# Altium project ESP32_With_USB-C_Port.PrjPcb
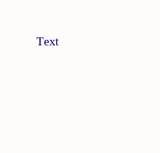
[diagram p0: ESP32_With_USB-C_Port_AL.SchDoc, top left]
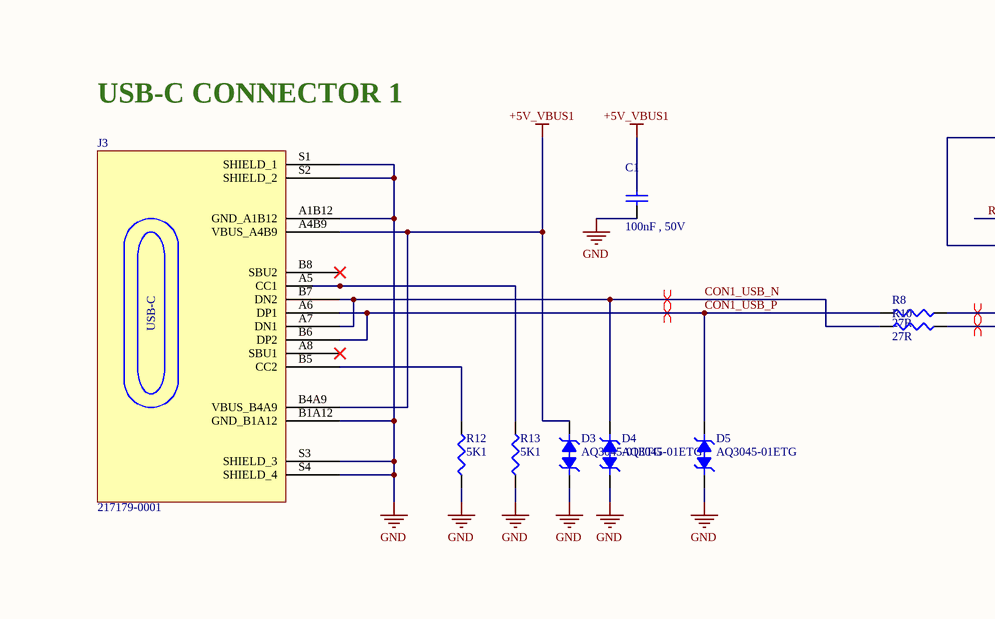
[diagram p1: ESP32_With_USB-C_Port_AL.SchDoc, top middle]
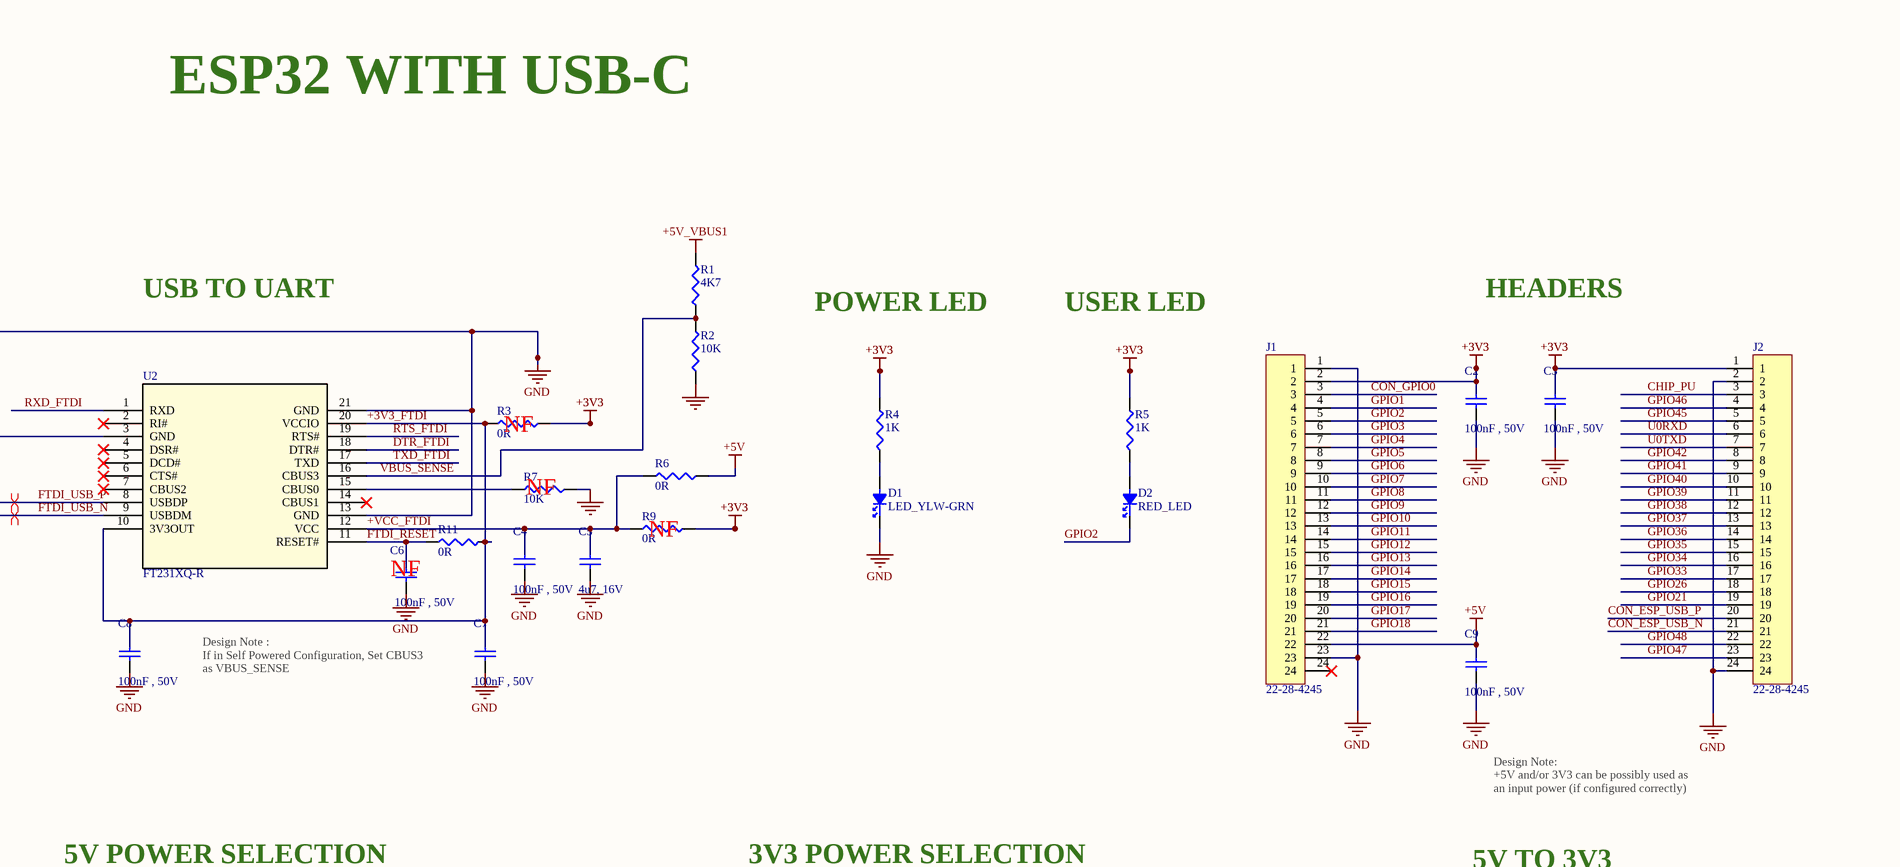
[diagram p2: ESP32_With_USB-C_Port_AL.SchDoc, top right]
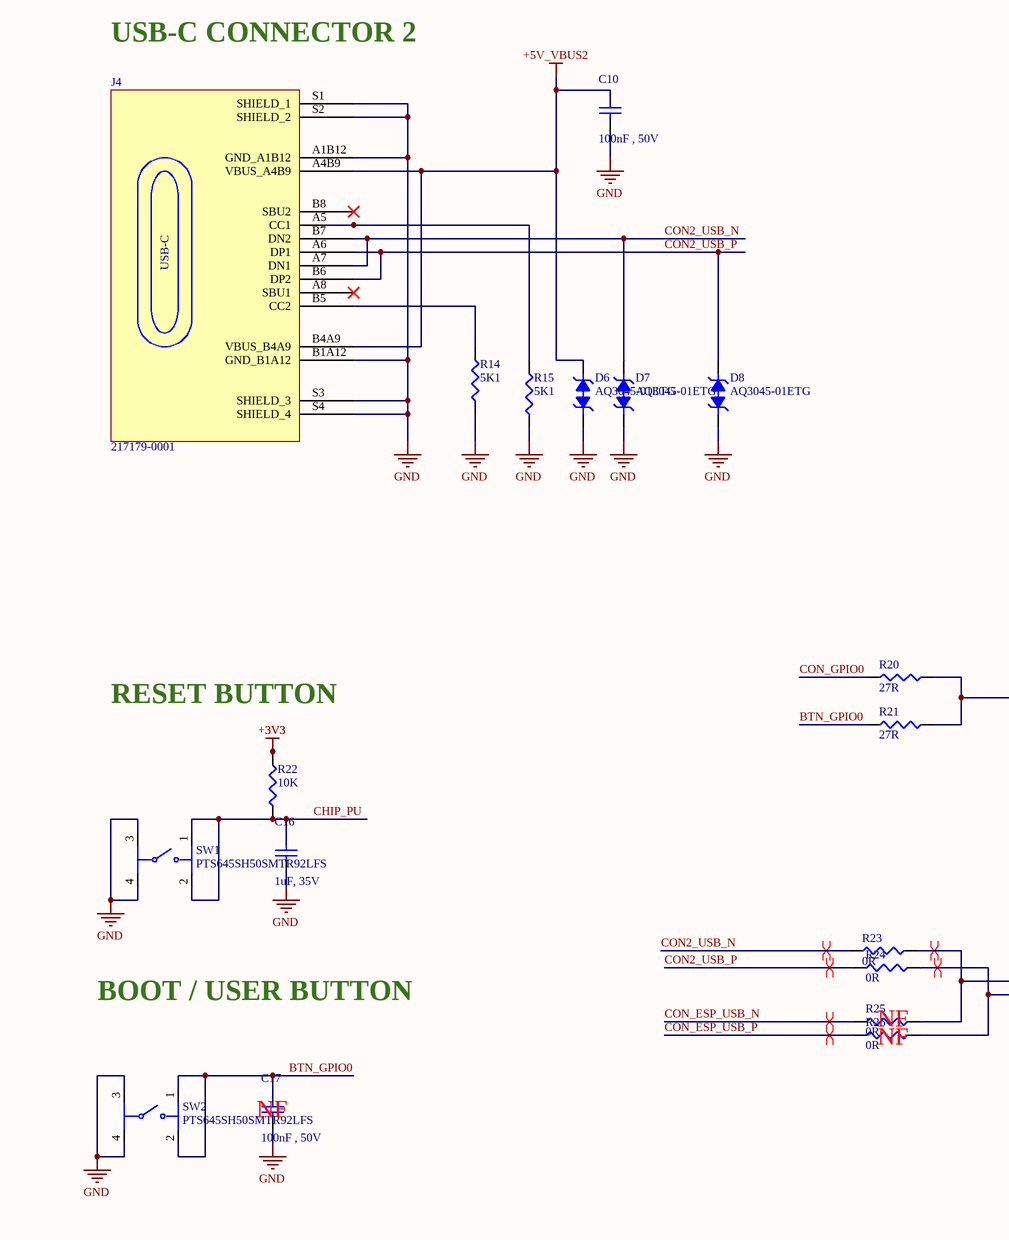
[diagram p3: ESP32_With_USB-C_Port_AL.SchDoc, bottom middle]
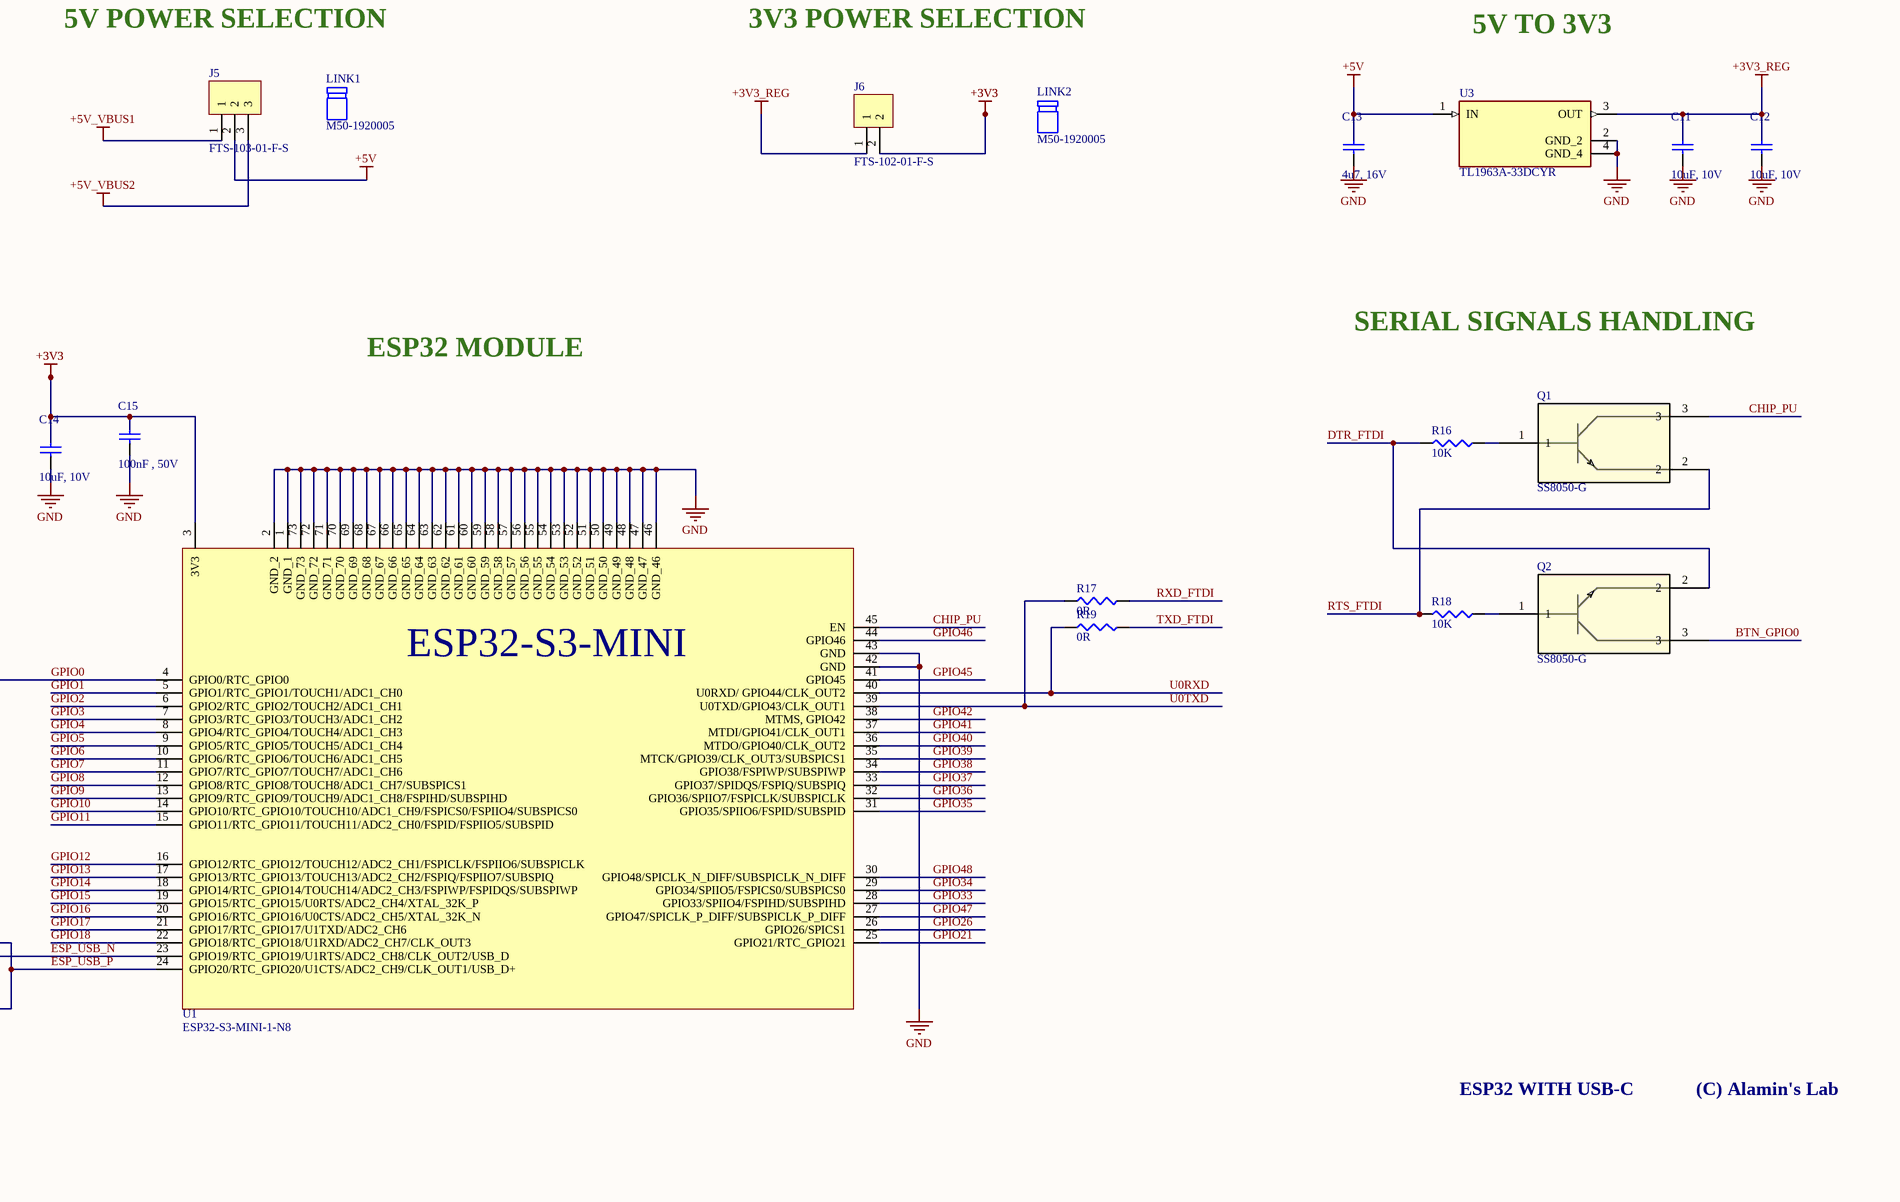
[diagram p4: ESP32_With_USB-C_Port_AL.SchDoc, bottom right]
1 sheet, 66 parts. Net scope: global (net labels, ports and power ports of the same name join across sheets).
Board file: ESP32_With_USB-C_Port_AL.PcbDoc

## Sheet ESP32_With_USB-C_Port_AL.SchDoc
size A2; SheetNumber: 1; SheetTotal: 1

### Parts
C1  100nF , 50V  [CAPC1005X70N_ALL]
C2  100nF , 50V  [CAPC1005X70N_ALL]
C3  100nF , 50V  [CAPC1005X70N_ALL]
C4  100nF , 50V  [CAPC1005X70N_ALL]
C5  4u7, 16V  [CAPC1005X70N_ALL]
C6  100nF , 50V  [CAPC1005X70N_ALL]
C7  100nF , 50V  [CAPC1005X70N_ALL]
C8  100nF , 50V  [CAPC1005X70N_ALL]
C9  100nF , 50V  [CAPC1005X70N_ALL]
C10  100nF , 50V  [CAPC1005X70N_ALL]
C11  10uF, 10V  [CAPC1005X70N_ALL]
C12  10uF, 10V  [CAPC1005X70N_ALL]
C13  4u7, 16V  [CAPC1005X70N_ALL]
C14  10uF, 10V  [CAPC1005X70N_ALL]
C15  100nF , 50V  [CAPC1005X70N_ALL]
C16  1uF, 35V  [CAPC1005X70N_ALL]
C17  100nF , 50V  [CAPC1005X70N_ALL]
D1  LED_YLW-GRN  [LED_0402_YLW_GR]
D2  RED_LED  [LED_0402_RED_01- duplicate]
D3  AQ3045-01ETG  [RTVS_SOD882_LTF-M]
D4  AQ3045-01ETG  [RTVS_SOD882_LTF-M]
D5  AQ3045-01ETG  [RTVS_SOD882_LTF-M]
D6  AQ3045-01ETG  [RTVS_SOD882_LTF-M]
D7  AQ3045-01ETG  [RTVS_SOD882_LTF-M]
D8  AQ3045-01ETG  [RTVS_SOD882_LTF-M]
J1  22-28-4245  [CONN_SD-42375-001_M295_24_MOL]
J2  22-28-4245  [CONN_SD-42375-001_M295_24_MOL]
J3  217179-0001  [MOLEX_2171790001]
J4  217179-0001  [MOLEX_2171790001]
J5  FTS-103-01-F-S  [CONN_FTS-103-01-x-S_SAI]
J6  FTS-102-01-F-S  [CONN_FTS-102-01-x-S_SAI]
LINK1  M50-1920005  (mechanical)
LINK2  M50-1920005  (mechanical)
Q1  SS8050-G  [TRAN_SS8050-G_CIP]
Q2  SS8050-G  [TRAN_SS8050-G_CIP]
R1  4K7  [RESC1005X40N]
R2  10K  [RESC1005X37N_10k]
R3  0R  [RESC1005X40_0]
R4  1K  [RESC1005X40N_1k]
R5  1K  [RESC1005X40N_1k]
R6  0R  [RESC1005X40_0]
R7  10K  [RESC1005X37N_10k]
R8  27R  [RESC1005X40N_27]
R9  0R  [RESC1005X40_0]
R10  27R  [RESC1005X40N_27]
R11  0R  [RESC1005X40_0]
R12  5K1  [RESC1005X37N_5.1]
R13  5K1  [RESC1005X37N_5.1]
R14  5K1  [RESC1005X37N_5.1]
R15  5K1  [RESC1005X37N_5.1]
R16  10K  [RESC1005X37N_10k]
R17  0R  [RESC1005X40_0]
R18  10K  [RESC1005X37N_10k]
R19  0R  [RESC1005X40_0]
R20  27R  [RESC1005X40N_27]
R21  27R  [RESC1005X40N_27]
R22  10K  [RESC1005X37N_10k]
R23  0R  [RESC1005X40_0]
R24  0R  [RESC1005X40_0]
R25  0R  [RESC1005X40_0]
R26  0R  [RESC1005X40_0]
SW1  PTS645SH50SMTR92LFS  [PTS645S_SMTR92_CNK]
SW2  PTS645SH50SMTR92LFS  [PTS645S_SMTR92_CNK]
U1  ESP32-S3-MINI-1-N8  [XCVR_ESP32-S3-MINI-1-N8]
U2  FT231XQ-R  [QFN20_FT231XQ_FTD-M]
U3  TL1963A-33DCYR  [VREG_TL1963A-33DCYR]

### Nets
+3V3: C2.2 C3.2 C14.2 C15.2 J1.2 J2.1 J6.2 R3.2 R4.2 R5.2 R9.2 R22.2 U1.3(3V3)
+3V3_REG: C11.2 C12.2 J6.1 U3.3(OUT)
+5V: C9.2 C13.2 J1.22 J5.2 R6.2 U3.1(IN)
+5V_VBUS1: C1.2 D3.2 J3.A4B9(VBUS_A4B9) J3.B4A9(VBUS_B4A9) J5.1 R1.2
+5V_VBUS2: C10.2 D6.2 J4.A4B9(VBUS_A4B9) J4.B4A9(VBUS_B4A9) J5.3
GND: C1.1 C2.1 C3.1 C4.1 C5.1 C6.1 C7.1 C8.1 C9.1 C10.1 C11.1 C12.1 C13.1 C14.1 C15.1 C16.1 C17.1 D1.1 D3.1 D4.1 D5.1 D6.1 D7.1 D8.1 J1.1 J1.23 J2.2 J2.24 J3.A1B12(GND_A1B12) J3.B1A12(GND_B1A12) J3.S1(SHIELD_1) J3.S2(SHIELD_2) J3.S3(SHIELD_3) J3.S4(SHIELD_4) J4.A1B12(GND_A1B12) J4.B1A12(GND_B1A12) J4.S1(SHIELD_1) J4.S2(SHIELD_2) J4.S3(SHIELD_3) J4.S4(SHIELD_4) R2.1 R7.2 R12.1 R13.1 R14.1 R15.1 SW1.3 SW1.4 SW2.3 SW2.4 U1.1(GND_1) U1.2(GND_2) U1.42(GND) U1.43(GND) U1.46(GND_46) U1.47(GND_47) U1.48(GND_48) U1.49(GND_49) U1.50(GND_50) U1.51(GND_51) U1.52(GND_52) U1.53(GND_53) U1.54(GND_54) U1.55(GND_55) U1.56(GND_56) U1.57(GND_57) U1.58(GND_58) U1.59(GND_59) U1.60(GND_60) U1.61(GND_61) U1.62(GND_62) U1.63(GND_63) U1.64(GND_64) U1.65(GND_65) U1.66(GND_66) U1.67(GND_67) U1.68(GND_68) U1.69(GND_69) U1.70(GND_70) U1.71(GND_71) U1.72(GND_72) U1.73(GND_73) U2.3(GND) U2.13(GND) U2.21(GND) U3.2(GND_2) U3.4(GND_4)
+3V3_FTDI: C7.2 C8.2 R3.1 R11.1 U2.10(3V3OUT) U2.20(VCCIO)
+VCC_FTDI: C4.2 C5.2 R6.1 R9.1 U2.12(VCC)
BTN_GPIO0: C17.2 Q2.3 R21.1 SW2.1 SW2.2
CHIP_PU: C16.2 J2.3 Q1.3 R22.1 SW1.1 SW1.2 U1.45(EN)
CON1_USB_N: D4.2 J3.A7(DN1) J3.B7(DN2) R10.1
CON1_USB_P: D5.2 J3.A6(DP1) J3.B6(DP2) R8.1
CON2_USB_N: D7.2 J4.A7(DN1) J4.B7(DN2) R23.1
CON2_USB_P: D8.2 J4.A6(DP1) J4.B6(DP2) R24.1
CON_ESP_USB_N: J2.21 R25.1
CON_ESP_USB_P: J2.20 R26.1
CON_GPIO0: J1.3 R20.1
DTR_FTDI: Q2.2 R16.2 U2.18(DTR#)
ESP_USB_N: R23.2 R25.2 U1.23(GPIO19/RTC_GPIO19/U1RTS/ADC2_CH8/CLK_OUT2/USB_D)
ESP_USB_P: R24.2 R26.2 U1.24(GPIO20/RTC_GPIO20/U1CTS/ADC2_CH9/CLK_OUT1/USB_D+)
FTDI_RESET: C6.2 R11.2 U2.11(RESET#)
FTDI_USB_N: R10.2 U2.9(USBDM)
FTDI_USB_P: R8.2 U2.8(USBDP)
GPIO0: R20.2 R21.2 U1.4(GPIO0/RTC_GPIO0)
GPIO1: J1.4 U1.5(GPIO1/RTC_GPIO1/TOUCH1/ADC1_CH0)
GPIO2: D2.1 J1.5 U1.6(GPIO2/RTC_GPIO2/TOUCH2/ADC1_CH1)
GPIO3: J1.6 U1.7(GPIO3/RTC_GPIO3/TOUCH3/ADC1_CH2)
GPIO4: J1.7 U1.8(GPIO4/RTC_GPIO4/TOUCH4/ADC1_CH3)
GPIO5: J1.8 U1.9(GPIO5/RTC_GPIO5/TOUCH5/ADC1_CH4)
GPIO6: J1.9 U1.10(GPIO6/RTC_GPIO6/TOUCH6/ADC1_CH5)
GPIO7: J1.10 U1.11(GPIO7/RTC_GPIO7/TOUCH7/ADC1_CH6)
GPIO8: J1.11 U1.12(GPIO8/RTC_GPIO8/TOUCH8/ADC1_CH7/SUBSPICS1)
GPIO9: J1.12 U1.13(GPIO9/RTC_GPIO9/TOUCH9/ADC1_CH8/FSPIHD/SUBSPIHD)
GPIO10: J1.13 U1.14(GPIO10/RTC_GPIO10/TOUCH10/ADC1_CH9/FSPICS0/FSPIIO4/SUBSPICS0)
GPIO11: J1.14 U1.15(GPIO11/RTC_GPIO11/TOUCH11/ADC2_CH0/FSPID/FSPIIO5/SUBSPID)
GPIO12: J1.15 U1.16(GPIO12/RTC_GPIO12/TOUCH12/ADC2_CH1/FSPICLK/FSPIIO6/SUBSPICLK)
GPIO13: J1.16 U1.17(GPIO13/RTC_GPIO13/TOUCH13/ADC2_CH2/FSPIQ/FSPIIO7/SUBSPIQ)
GPIO14: J1.17 U1.18(GPIO14/RTC_GPIO14/TOUCH14/ADC2_CH3/FSPIWP/FSPIDQS/SUBSPIWP)
GPIO15: J1.18 U1.19(GPIO15/RTC_GPIO15/U0RTS/ADC2_CH4/XTAL_32K_P)
GPIO16: J1.19 U1.20(GPIO16/RTC_GPIO16/U0CTS/ADC2_CH5/XTAL_32K_N)
GPIO17: J1.20 U1.21(GPIO17/RTC_GPIO17/U1TXD/ADC2_CH6)
GPIO18: J1.21 U1.22(GPIO18/RTC_GPIO18/U1RXD/ADC2_CH7/CLK_OUT3)
GPIO21: J2.19 U1.25(GPIO21/RTC_GPIO21)
GPIO26: J2.18 U1.26(GPIO26/SPICS1)
GPIO33: J2.17 U1.28(GPIO33/SPIIO4/FSPIHD/SUBSPIHD)
GPIO34: J2.16 U1.29(GPIO34/SPIIO5/FSPICS0/SUBSPICS0)
GPIO35: J2.15 U1.31(GPIO35/SPIIO6/FSPID/SUBSPID)
GPIO36: J2.14 U1.32(GPIO36/SPIIO7/FSPICLK/SUBSPICLK)
GPIO37: J2.13 U1.33(GPIO37/SPIDQS/FSPIQ/SUBSPIQ)
GPIO38: J2.12 U1.34(GPIO38/FSPIWP/SUBSPIWP)
GPIO39: J2.11 U1.35(MTCK/GPIO39/CLK_OUT3/SUBSPICS1)
GPIO40: J2.10 U1.36(MTDO/GPIO40/CLK_OUT2)
GPIO41: J2.9 U1.37(MTDI/GPIO41/CLK_OUT1)
GPIO42: J2.8 U1.38(MTMS,_GPIO42)
GPIO45: J2.5 U1.41(GPIO45)
GPIO46: J2.4 U1.44(GPIO46)
GPIO47: J2.23 U1.27(GPIO47/SPICLK_P_DIFF/SUBSPICLK_P_DIFF)
GPIO48: J2.22 U1.30(GPIO48/SPICLK_N_DIFF/SUBSPICLK_N_DIFF)
RTS_FTDI: Q1.2 R18.2 U2.19(RTS#)
RXD_FTDI: R17.2 U2.1(RXD)
TXD_FTDI: R19.2 U2.17(TXD)
U0RXD: J2.6 R19.1 U1.40(U0RXD/_GPIO44/CLK_OUT2)
U0TXD: J2.7 R17.1 U1.39(U0TXD/GPIO43/CLK_OUT1)
VBUS_SENSE: R1.1 R2.2 U2.16(CBUS3)
NetD1_2: D1.2 R4.1
NetD2_2: D2.2 R5.1
NetJ3_A5: J3.A5(CC1) R13.2
NetJ3_B5: J3.B5(CC2) R12.2
NetJ4_A5: J4.A5(CC1) R15.2
NetJ4_B5: J4.B5(CC2) R14.2
NetQ1_1: Q1.1 R16.1
NetQ2_1: Q2.1 R18.1
NetR7_1: R7.1 U2.15(CBUS0)

Not connected (* = marked no-connect by the designer): J1 24*; J3 A8(SBU1)* B8(SBU2)*; J4 A8(SBU1)* B8(SBU2)*; U2 2(RI#)* 4(DSR#)* 5(DCD#)* 6(CTS#)* 7(CBUS2)* 14(CBUS1)*

### Layout directives
differential pair; differential pair class DIFF90: CON1_USB_N, CON1_USB_P, CON2_USB_N, CON2_USB_P, CON_ESP_USB_N, CON_ESP_USB_P, ESP_USB_N, ESP_USB_P, FTDI_USB_N, FTDI_USB_P

### Notes on the sheet
- Text
- ESP32 WITH USB-C
- USB-C CONNECTOR 1
- USB TO UART
- HEADERS
- POWER LED
- USER LED
- (near R3) NF
- (near R7) NF
- (near C6) NF
- (near R9) NF
- Design Note :
  If in Self Powered Configuration, Set CBUS3 as VBUS_SENSE
- Design Note:
  +5V and/or 3V3 can be possibly used as an input power (if configured correctly)
- USB-C CONNECTOR 2
- 5V POWER SELECTION
- 3V3 POWER SELECTION
- 5V TO 3V3
- ESP32 MODULE
- SERIAL SIGNALS HANDLING
- RESET BUTTON
- BOOT / USER BUTTON
- NF
- (near C17) NF
- (C) Alamin's Lab
- (in symbol 217179-0001) USB-C
- (in symbol ESP32-S3-MINI-1-N8) ESP32-S3-MINI

### Library data of the parts
C1-C4 C6-C10 C15 C17 = CL05B104KB54PNC: CAP CER 0.1UF 50V X7R 0402; Manufacturer: Samsung; Material: 4241ConductorMaterial; Tolerance: 10%; Supplier: Digikey; Supplier Part Number: 1276-CL05B104KB54PNCDKR-ND; Manufacturer Part Number: CL05B104KB54PNC; RoHS: Yes; Category: Ceramic Capacitors; Stock: 1836220; Pricing: 1=0.1, 10=0.037, 100=0.0211, 1000=0.01333, 2500=0.01141, 5000=0.01026 (USD); Case/Package: 343Case; Min Operating Temperature: -55°C; Max Operating Temperature: 125°C; Value: 100nF; Voltage Rating: 50V; Height: 550um; RoHS Compliant: Yes; LCSC Part Number: C307331
C5 C13 = CL05A475MO5NUNC: CAP CER 4.7UF 16V X5R 0402; Manufacturer: Samsung; Tolerance: 20%; Supplier: Digikey; Supplier Part Number: 1276-6836-1-ND; Manufacturer Part Number: CL05A475MO5NUNC; RoHS: Yes; Category: Ceramic Capacitors; Stock: 102750; Pricing: 1=0.19, 10=0.114, 100=0.0851 (USD); Mounting Technology: Surface Mount; Case/Package: 0402; Case Code (Metric): 1005; Case Code (Imperial): 0402; Min Operating Temperature: -55°C; Max Operating Temperature: 85°C; Packaging: Cut Tape; Value: 4.7uF; Voltage Rating: 16V; Series: CL; Voltage Rating (DC): 16V; Length: 0.039inch; Width: 0.02inch; Height: 550um; Thickness: 0.022inch; RoHS Compliant: Yes; ComponentLink1URL: http://www.farnell.com/datasheets/2710653.pdf?src-supplier=Farnell; ComponentLink1Description: http://www.farnell.com/datasheets/2710653.pdf?src-supplier=Farnell; ComponentLink2URL: http://www.samsungsem.com/kr/support/product-search/mlcc/CL05A475MO5NUNC.jsp?src-supplier=Digikey; ComponentLink2Description: http://www.samsungsem.com/kr/support/product-search/mlcc/CL05A475MO5NUNC.jsp?src-supplier=Digikey; ComponentLink3URL: http://www.farnell.com/datasheets/2710653.pdf?src-supplier=Element14; ComponentLink3Description: http://www.farnell.com/datasheets/2710653.pdf?src-supplier=Element14; ComponentLink4URL: https://datasheet.octopart.com/CL05A475MO5NUNC-Samsung-Electro-Mechanics-datasheet-123102911.pdf?src-supplier=Future+Electronics; ComponentLink4Description: https://datasheet.octopart.com/CL05A475MO5NUNC-Samsung-Electro-Mechanics-datasheet-123102911.pdf?src-supplier=Future+Electronics; ComponentLink5URL: http://www.farnell.com/datasheets/2710653.pdf?src-supplier=Newark; ComponentLink5Description: http://www.farnell.com/datasheets/2710653.pdf?src-supplier=Newark; LCSC Part Number: C318563
C11 C12 C14 = CL05A106MP8NUB8: CAP CER 10UF 10V X5R 0402; Manufacturer: Samsung; Material: 4241ConductorMaterial; Tolerance: 20%; Supplier: Digikey; Supplier Part Number: 1276-6830-6-ND; Manufacturer Part Number: CL05A106MP8NUB8; RoHS: Yes; Category: Ceramic Capacitors; Stock: 116604; Pricing: 1=0.2, 10=0.12, 100=0.0808, 1000=0.06854 (USD); Mounting Technology: Surface Mount; Case/Package: 0402; Case Code (Metric): 1005; Case Code (Imperial): 0402; Min Operating Temperature: -55°C; Max Operating Temperature: 85°C; Packaging: Cut Tape; Value: 10uF; Voltage Rating: 10V; Series: CL; Length: 0.039inch; Width: 0.02inch; Height: 550um; Thickness: 0.035inch; RoHS Compliant: Yes; ComponentLink1URL: http://www.samsungsem.com/kr/support/product-search/mlcc/CL05A106MP8NUB8.jsp?src-supplier=Digikey; ComponentLink1Description: http://www.samsungsem.com/kr/support/product-search/mlcc/CL05A106MP8NUB8.jsp?src-supplier=Digikey; ComponentLink2URL: https://datasheet.octopart.com/CL05A106MP8NUB8-Samsung-Electro-Mechanics-datasheet-136460857.pdf?src-supplier=Future+Electronics; ComponentLink2Description: https://datasheet.octopart.com/CL05A106MP8NUB8-Samsung-Electro-Mechanics-datasheet-136460857.pdf?src-supplier=Future+Electronics; LCSC Part Number: C307415
C16 = CL05A106MP8NUB8 (2): CAP CER 1UF 35V X5R 0402; Manufacturer: Samsung; Material: 4241ConductorMaterial; Value: 10uF; Voltage Rating: 10V; Tolerance: 20%; Supplier: Digikey; Supplier Part Number: 1276-6830-1-ND; Manufacturer Part Number: CL05A106MP8NUB8; RoHS: Yes; Category: Ceramic Capacitors; Stock: 116604; Pricing: 1=0.2, 10=0.12, 100=0.0808, 1000=0.06854 (USD); Mounting Technology: Surface Mount; Case/Package: 0402; Case Code (Metric): 1005; Case Code (Imperial): 0402; Min Operating Temperature: -55°C; Max Operating Temperature: 85°C; Packaging: Cut Tape; Series: CL; Length: 0.039inch; Width: 0.02inch; Height: 550um; Thickness: 0.035inch; RoHS Compliant: Yes; ComponentLink1URL: http://www.samsungsem.com/kr/support/product-search/mlcc/CL05A106MP8NUB8.jsp?src-supplier=Digikey; ComponentLink1Description: http://www.samsungsem.com/kr/support/product-search/mlcc/CL05A106MP8NUB8.jsp?src-supplier=Digikey; ComponentLink2URL: https://datasheet.octopart.com/CL05A106MP8NUB8-Samsung-Electro-Mechanics-datasheet-136460857.pdf?src-supplier=Future+Electronics; ComponentLink2Description: https://datasheet.octopart.com/CL05A106MP8NUB8-Samsung-Electro-Mechanics-datasheet-136460857.pdf?src-supplier=Future+Electronics; LCSC Part Number: C307413
D1 = VLMG1500-GS08: LED YLW-GRN 0402 SMD; Manufacturer: Vishay; Color: Green,Yellow; Lens Color: Clear; Viewing Angle: 130°; Illumination Color: Green; Forward Current: 30mA; Forward Voltage: 2V; Luminous Intensity: 35mcd; Dominant Wavelength: 571nm; Test Current: 20mA; Number of Elements: 1; Power Dissipation: 75mW; Lens Style: Rectangular; Reverse Voltage: 5V; Supplier: Digikey; Supplier Part Number: VLMG1500-GS08CT-ND; Manufacturer Part Number: VLMG1500-GS08; RoHS: Yes; Category: LEDs; Stock: 150454; Pricing: 1=0.24, 10=0.164, 100=0.1147, 500=0.09218, 1000=0.0847 (USD); Mounting Technology: Surface Mount; Case/Package: 0402; Pins: 2; Case Code (Metric): 1005; Case Code (Imperial): 0402; Min Operating Temperature: -30°C; Max Operating Temperature: 85°C; Package Quantity: 1; Packaging: Tape and Reel; Wavelength: 571nm; Number of LEDs: 1; Power Rating: 75mW; Series: CHipLED; Length: 1mm; Width: 0.5mm; Height: 0.35mm; Depth: 0.5mm; Radiation Hardening: No; Lead Free: Lead Free; RoHS Compliant: Yes; Reach SVHC Compliant: Unknown; ComponentLink1URL: https://datasheet.ciiva.com/12071/vlmo1500-244705-12071911.pdf?src-supplier=Mouser; ComponentLink1Description: https://datasheet.ciiva.com/12071/vlmo1500-244705-12071911.pdf?src-supplier=Mouser; ComponentLink2URL: https://datasheet.ciiva.com/30005/vlmo1500-30005134.pdf?src-supplier=Avnet; ComponentLink2Description: https://datasheet.ciiva.com/30005/vlmo1500-30005134.pdf?src-supplier=Avnet; LCSC Part Number: C511404
D2 = VLMS1500-GS08: LED RED 0402 SMD; Manufacturer: Vishay; Viewing Angle: 130°; Forward Current: 30mA; Forward Voltage: 2V; Luminous Intensity: 54mcd; Dominant Wavelength: 631nm; Test Current: 20mA; Lens Style: Flat,Rectangular,Square; Number of LEDs: 1; Power Rating: 75mW; Lens Size: 0.5mm; Supplier: Digikey; Supplier Part Number: VLMS1500-GS08CT-ND; Manufacturer Part Number: VLMS1500-GS08; RoHS: Yes; Category: LEDs; Stock: 64500; Pricing: 1=0.24, 10=0.164, 100=0.1147, 500=0.09218, 1000=0.0847 (USD); Mounting Technology: Surface Mount; Case/Package: 0402; Pins: 2; Color: Red; Case Code (Metric): 1005; Case Code (Imperial): 0402; Min Operating Temperature: -30°C; Max Operating Temperature: 85°C; Package Quantity: 9000; Packaging: Tape and Reel; Illumination Color: Red; Wavelength: 631nm; Series: CHipLED; Length: 1mm; Width: 0.5mm; Height: 0.55mm; Radiation Hardening: No; Lead Free: Lead Free; RoHS Compliant: Yes; Reach SVHC Compliant: Unknown; ComponentLink1URL: http://components.arrow.com/part/dataview/56357384S461524N5680?src-supplier=Arrow+Electronics; ComponentLink1Description: http://components.arrow.com/part/dataview/56357384S461524N5680?src-supplier=Arrow+Electronics; ComponentLink2URL: http://www.mouser.com/ds/2/427/vlmo1500-244705.pdf?src-supplier=Mouser; ComponentLink2Description: http://www.mouser.com/ds/2/427/vlmo1500-244705.pdf?src-supplier=Mouser; ComponentLink3URL: http://www.farnell.com/datasheets/1809983.pdf?src-supplier=Farnell; ComponentLink3Description: http://www.farnell.com/datasheets/1809983.pdf?src-supplier=Farnell; ComponentLink4URL: http://www.alliedelec.com/m/d/cfc385e1097fc985ee9a50a3551ac188.pdf?src-supplier=Allied+Electronics; ComponentLink4Description: http://www.alliedelec.com/m/d/cfc385e1097fc985ee9a50a3551ac188.pdf?src-supplier=Allied+Electronics; ComponentLink5URL: https://datasheet.octopart.com/VLMS1500-GS08-Vishay-datasheet-62332426.pdf?src-supplier=Newark; ComponentLink5Description: https://datasheet.octopart.com/VLMS1500-GS08-Vishay-datasheet-62332426.pdf?src-supplier=Newark; ComponentLink6URL: http://www.vishay.com/docs/82554/vlmo1500.pdf?src-supplier=Avnet; ComponentLink6Description: http://www.vishay.com/docs/82554/vlmo1500.pdf?src-supplier=Avnet; ComponentLink7URL: https://datasheet.octopart.com/VLMS1500-GS08-Vishay-datasheet-21227148.pdf?src-supplier=Future+Electronics; ComponentLink7Description: https://datasheet.octopart.com/VLMS1500-GS08-Vishay-datasheet-21227148.pdf?src-supplier=Future+Electronics; ComponentLink8URL: http://www.farnell.com/datasheets/2050839.pdf?src-supplier=Newark; ComponentLink8Description: http://www.farnell.com/datasheets/2050839.pdf?src-supplier=Newark; ComponentLink9URL: http://www.farnell.com/datasheets/1809983.pdf?src-supplier=Element14; ComponentLink9Description: http://www.farnell.com/datasheets/1809983.pdf?src-supplier=Element14; ComponentLink10URL: https://datasheet.octopart.com/VLMS1500-GS08-Vishay-datasheet-33014519.pdf?src-supplier=Element14; ComponentLink10Description: https://datasheet.octopart.com/VLMS1500-GS08-Vishay-datasheet-33014519.pdf?src-supplier=Element14; ComponentLink11URL: http://www.farnell.com/datasheets/1809983.pdf?src-supplier=Newark; ComponentLink11Description: http://www.farnell.com/datasheets/1809983.pdf?src-supplier=Newark; ComponentLink12URL: http://datasheet.octopart.com/VLMS1500-GS08-Vishay-datasheet-21227148.pdf?src-supplier=Avnet; ComponentLink12Description: http://datasheet.octopart.com/VLMS1500-GS08-Vishay-datasheet-21227148.pdf?src-supplier=Avnet; ComponentLink13URL: http://datasheet.octopart.com/VLMS1500-GS08-Vishay-datasheet-21227148.pdf?src-supplier=LCSC; ComponentLink13Description: http://datasheet.octopart.com/VLMS1500-GS08-Vishay-datasheet-21227148.pdf?src-supplier=LCSC; ComponentLink14URL: http://datasheet.octopart.com/VLMS1500-GS08-Vishay-datasheet-21227148.pdf?src-supplier=Quest; ComponentLink14Description: http://datasheet.octopart.com/VLMS1500-GS08-Vishay-datasheet-21227148.pdf?src-supplier=Quest; ComponentLink15URL: http://datasheet.octopart.com/VLMS1500-GS08-Vishay-datasheet-21227148.pdf?src-supplier=NAC+Semi; ComponentLink15Description: http://datasheet.octopart.com/VLMS1500-GS08-Vishay-datasheet-21227148.pdf?src-supplier=NAC+Semi; LCSC Part Number: C511370
D3-D8 = AQ3045-01ETG: TVS DIODE 5.3VWM 12VC SOD882; Manufacturer: Littelfuse; Number of Bidirectional Channels: 1; Reverse Standoff Voltage: 5.3V; Min Breakdown Voltage: 6.8V; Peak Pulse Current: 3A; Peak Pulse Power: 40W; Power Line Protection: No; Diode Type: ZENER; Leakage Current: 100nA; Number of Channels: 1NUMBER; Supplier: Digikey; Supplier Part Number: F9321CT-ND; Manufacturer Part Number: AQ3045-01ETG; RoHS: Yes; Category: TVS Diodes; Stock: 10015; Pricing: 1=0.46, 10=0.302, 100=0.141, 500=0.1335, 1000=0.1302 (USD); Mounting Technology: Surface Mount; Min Operating Temperature: -55°C; Max Operating Temperature: 150°C; Packaging: Cut Tape; Series: Automotive, AEC-Q101, AQ3045, SPA®; Operating Supply Voltage: 5.3V; RoHS Compliant: Yes; ComponentLink1URL: https://www.littelfuse.com/~/media/electronics/datasheets/tvs_diode_arrays/littelfuse_tvs_diode_array_aq3045_datasheet.pdf.pdf?src-supplier=Digikey; ComponentLink1Description: https://www.littelfuse.com/~/media/electronics/datasheets/tvs_diode_arrays/littelfuse_tvs_diode_array_aq3045_datasheet.pdf.pdf?src-supplier=Digikey; ComponentLink2URL: http://www.littelfuse.com/~/media/electronics/datasheets/tvs_diode_arrays/littelfuse_tvs_diode_array_aq3045_datasheet.pdf.pdf?src-supplier=Digikey; ComponentLink2Description: http://www.littelfuse.com/~/media/electronics/datasheets/tvs_diode_arrays/littelfuse_tvs_diode_array_aq3045_datasheet.pdf.pdf?src-supplier=Digikey; LCSC Part Number: C3710326
J1 J2 = 22-28-4245: CONN HEADER VERT 24POS 2.54MM; Manufacturer: Molex; Plating: Tin; Current Rating: 4A; Gender: Male; Number of Circuits: 24; Supplier: Digikey; Supplier Part Number: 900-0022284245-ND; Manufacturer Part Number: 22-28-4245; RoHS: No; Category: Headers and Wire Housings; Stock: 1840; Pricing: 1=1.21, 10=1.024, 100=0.8699, 500=0.77638, 1000=0.73932, 5000=0.65998, 10000=0.62851 (USD); Mounting Technology: Through Hole; Contact Material: Brass; Contact Plating: Gold; Housing Color: Black; Number of Contacts: 24; Number of Positions: 24; Number of Rows: 1; Orientation: Vertical; Packaging: Bulk; Termination: Solder; Pitch: 2.54mm; Lead Free: Lead Free; ComponentLink1URL: https://datasheet.ciiva.com/6814/022284363-sd-6814049.pdf?src-supplier=Digikey; ComponentLink1Description: https://datasheet.ciiva.com/6814/022284363-sd-6814049.pdf?src-supplier=Digikey; ComponentLink2URL: https://datasheet.ciiva.com/10075/0022284245-pcb-headers-10075617.pdf?src-supplier=Avnet; ComponentLink2Description: https://datasheet.ciiva.com/10075/0022284245-pcb-headers-10075617.pdf?src-supplier=Avnet; ComponentLink3URL: https://datasheet.ciiva.com/1433/1597854-1433759.pdf?src-supplier=Element14; ComponentLink3Description: https://datasheet.ciiva.com/1433/1597854-1433759.pdf?src-supplier=Element14; LCSC Part Number: C7145888
J3 J4 = 217179-0001: CONN RCP USB2.0 TYP C 24P SMD RA; Manufacturer: Molex; Current Rating: 1.25A; Gender: Receptacle; Number of Contacts: 16; Voltage Rating: 30V; Supplier: Digikey; Supplier Part Number: 900-2171790001CT-ND; Manufacturer Part Number: 217179-0001; RoHS: No; Category: Connectors; Stock: 13840; Pricing: 1=0.83, 10=0.704, 25=0.6596, 50=0.628, 100=0.598, 250=0.56052, 500=0.53374 (USD); Contact Material: Nickel,Gold; Min Operating Temperature: -40°C; Max Operating Temperature: 85°C; USB Standard: USB 2.0; Height: 3.36mm; LCSC Part Number: C3197684
J5 = FTS-103-01-F-S: CONN HEADER VERT 3POS 1.27MM; Manufacturer: Samtec; Gender: 29Gender; Supplier: Digikey; Supplier Part Number: 612-FTS-103-01-F-S-ND; Manufacturer Part Number: FTS-103-01-F-S; RoHS: Yes; Category: Connectors; Stock: 1344; Pricing: 1=0.73, 50=0.6378, 100=0.5407, 500=0.4491, 1000=0.38362, 2000=0.31431, 5000=0.2478, 10000=0.228 (USD); ComponentLink1URL: http://www.samtec.com/documents/webfiles/pdf/FTS.pdf?src-supplier=Avnet; ComponentLink1Description: http://www.samtec.com/documents/webfiles/pdf/FTS.pdf?src-supplier=Avnet; ComponentLink2URL: http://suddendocs.samtec.com/prints/fts-1xx-xx-xx-xx-xx-mkt.pdf?src-supplier=Digikey; ComponentLink2Description: http://suddendocs.samtec.com/prints/fts-1xx-xx-xx-xx-xx-mkt.pdf?src-supplier=Digikey; ComponentLink3URL: https://datasheet.octopart.com/FTS-103-01-F-S-Samtec-datasheet-116535195.pdf?src-supplier=Toby+Electronics; ComponentLink3Description: https://datasheet.octopart.com/FTS-103-01-F-S-Samtec-datasheet-116535195.pdf?src-supplier=Toby+Electronics; ComponentLink4URL: https://datasheet.octopart.com/FTS-103-01-F-S-Samtec-datasheet-151470456.pdf?src-supplier=Sager+Electronics; ComponentLink4Description: https://datasheet.octopart.com/FTS-103-01-F-S-Samtec-datasheet-151470456.pdf?src-supplier=Sager+Electronics; ComponentLink5URL: https://datasheet.octopart.com/FTS-103-01-F-S-Samtec-datasheet-118493358.pdf?src-supplier=Electro+Sonic; ComponentLink5Description: https://datasheet.octopart.com/FTS-103-01-F-S-Samtec-datasheet-118493358.pdf?src-supplier=Electro+Sonic; LCSC Part Number: C3333578
J6 = FTS-102-01-F-S: CONN HEADER VERT 2POS 1.27MM; Manufacturer: Samtec; Number of Contacts: 2; Gender: Male; Supplier: Digikey; Supplier Part Number: SAM15176-ND; Manufacturer Part Number: FTS-102-01-F-S; RoHS: Yes; Category: Connectors; Stock: 165; Pricing: 1=0.49, 50=0.4252, 100=0.3608, 500=0.2994, 1000=0.25609, 2000=0.252 (USD); Mounting Technology: Through Hole; Contact Plating: Gold; Contact Material: Bronze; Contact Shape: Square; Contact Finish - Mating: GOLD; Insulation Material: Polymer; Insulation Color: Black; Min Operating Temperature: -55°C; Max Operating Temperature: 125°C; Number of Rows: 1; Packaging: Bulk; Termination: Solder; Fastening Type: Pull; Series: FTS; Contact Type: Male Pin; Number of Positions: 2; Pitch: 1.27mm; Radiation Hardening: No; RoHS Compliant: Yes; Flammability Rating: UL94 V-0; ComponentLink1URL: http://www.samtec.com/documents/webfiles/pdf/FTS.pdf?src-supplier=Avnet; ComponentLink1Description: http://www.samtec.com/documents/webfiles/pdf/FTS.pdf?src-supplier=Avnet; ComponentLink2URL: https://datasheet.octopart.com/FTS-102-01-F-S-Samtec-datasheet-118493358.pdf?src-supplier=Electro+Sonic; ComponentLink2Description: https://datasheet.octopart.com/FTS-102-01-F-S-Samtec-datasheet-118493358.pdf?src-supplier=Electro+Sonic; LCSC Part Number: C6045317
LINK1 LINK2 = M50-1920005: CONN SHUNT 1.27MM RED; Manufacturer: Harwin; Supplier: Digikey; Supplier Part Number: 952-1727-ND; Manufacturer Part Number: M50-1920005; RoHS: Yes; Category: Headers and Wire Housings; Stock: 5645; Pricing: 1=0.33, 10=0.284, 25=0.2664, 50=0.2536, 100=0.2414, 250=0.22628, 500=0.21546, 1000=0.20516, 3000=0.18984 (USD); ComponentLink1URL: https://datasheet.ciiva.com/4573/m50-19x-350826-4573042.pdf?src-supplier=Mouser; ComponentLink1Description: https://datasheet.ciiva.com/4573/m50-19x-350826-4573042.pdf?src-supplier=Mouser; ComponentLink2URL: https://datasheet.ciiva.com/1456/m50-19x-1456640.pdf?src-supplier=Newark; ComponentLink2Description: https://datasheet.ciiva.com/1456/m50-19x-1456640.pdf?src-supplier=Newark; ComponentLink3URL: https://datasheet.ciiva.com/1412/1836978-1412125.pdf?src-supplier=Element14; ComponentLink3Description: https://datasheet.ciiva.com/1412/1836978-1412125.pdf?src-supplier=Element14; ComponentLink4URL: https://datasheet.ciiva.com/767/m50-19x-767921.pdf?src-supplier=Digikey; ComponentLink4Description: https://datasheet.ciiva.com/767/m50-19x-767921.pdf?src-supplier=Digikey; LCSC Part Number: C6985646
Q1 Q2 = SS8050-G: TRANS NPN 25V 1.5A SOT-23-3; Manufacturer: Comchip; Max Power Dissipation: 300mW; Transition Frequency: 100MHz; Collector-emitter Voltage-Max: 400mV; Collector Base Voltage (VCBO): 40V; Collector Emitter Saturation Voltage: 500mV; Emitter Base Voltage (VEBO): 5V; hFE Min: 200; Number of Elements: 1; Supplier: Digikey; Supplier Part Number: 641-1790-1-ND; Manufacturer Part Number: SS8050-G; RoHS: Yes; Category: Transistors; Stock: 126714; Pricing: 1=0.24, 10=0.148, 100=0.0921, 500=0.06754, 1000=0.05958 (USD); Mounting Technology: Surface Mount; Case/Package: TO-236-3; Max Operating Temperature: 150°C; Packaging: Cut Tape; Max Collector Current: 1.5A; Collector Emitter Breakdown Voltage: 25V; Max Breakdown Voltage: 25V; Series: -; Power Dissipation: 300mW; Height: 1.15mm; RoHS Compliant: Yes; ComponentLink1URL: http://www.comchiptech.com/admin/files/product/SS8050-G RevA181526.pdf?src-supplier=Digikey; ComponentLink1Description: http://www.comchiptech.com/admin/files/product/SS8050-G RevA181526.pdf?src-supplier=Digikey; LCSC Part Number: C164886
R1 = RC0402FR-074K7L: RES 4.7K OHM 1% 1/16W 0402; Manufacturer: Yageo; Voltage Rating (DC): 50V; Power Rating: 62.5mW; Value: 4.7kR; Temperature Coefficient: 100ppm/°C; Max Power Dissipation: 63mW; Supplier: Digikey; Supplier Part Number: 311-4.7KLRCT-ND; Manufacturer Part Number: RC0402FR-074K7L; RoHS: Yes; Category: Chip SMD Resistors; Pricing: 1=0.1, 10=0.02, 100=0.009, 1000=0.00474, 2500=0.00381, 5000=0.00328 (USD); Case/Package: 0402; Pins: 2; Case Code (Imperial): 0402; Case Code (Metric): 1005; Min Operating Temperature: -55°C; Max Operating Temperature: 155°C; Tolerance: 1%; Voltage Rating: 50V; Packaging: Tape and Reel; Termination: SMD/SMT; Voltage Rating (AC): 50V; Resistor Type: Thick Film; Features: Moisture Resistant; Series: RC; Number of Terminations: 2; Resistance Tolerance: 1%; Construction: Rectangular; Length: 1mm; Width: 0.5mm; Depth: 0.5mm; Reach SVHC Compliant: No; Military Standard: Not; Lead Free: Lead Free; RoHS Compliant: Yes; ComponentLink1URL: https://datasheet.ciiva.com/22661/1686128-22661342.pdf?src-supplier=Element14; ComponentLink1Description: https://datasheet.ciiva.com/22661/1686128-22661342.pdf?src-supplier=Element14; ComponentLink2URL: https://datasheet.ciiva.com/7850/1018594-7850022.pdf?src-supplier=Element14; ComponentLink2Description: https://datasheet.ciiva.com/7850/1018594-7850022.pdf?src-supplier=Element14; ComponentLink3URL: https://datasheet.ciiva.com/7850/1018594-7850023.pdf?src-supplier=Element14; ComponentLink3Description: https://datasheet.ciiva.com/7850/1018594-7850023.pdf?src-supplier=Element14; LCSC Part Number: C105871
R2 R7 R16 R18 R22 = AC0402FR-0710KL: RES SMD 10K OHM 1% 1/16W 0402; Manufacturer: Yageo; Value: 10kR; Power Rating: 62.5mW; Voltage Rating: 50V; Temperature Coefficient: 100ppm/°C; Max Power Dissipation: 63mW; Supplier: Digikey; Supplier Part Number: YAG3436CT-ND; Manufacturer Part Number: AC0402FR-0710KL; RoHS: Yes; Category: Chip SMD Resistors; Stock: 1055987; Pricing: 1=0.1, 10=0.009, 100=0.0082, 1000=0.00612, 2500=0.0051 (USD); Case/Package: 0402; Case Code (Imperial): 0402; Case Code (Metric): 1005; Min Operating Temperature: -55°C; Max Operating Temperature: 155°C; Tolerance: 1%; Packaging: Tape and Reel; Termination: SMD/SMT; Number of Terminations: 2; Features: Moisture Resistant,Automotive AEC-Q200; Series: AC; Length: 0.039inch; Width: 0.02inch; Height: 0.015inch; RoHS Compliant: Yes; Lead Free: 5697LeadFree; ComponentLink1URL: https://datasheet.ciiva.com/12656/pyu-ac-51-rohs-l-2-12656634.pdf?src-supplier=Mouser; ComponentLink1Description: https://datasheet.ciiva.com/12656/pyu-ac-51-rohs-l-2-12656634.pdf?src-supplier=Mouser; LCSC Part Number: C144807
R3 R6 R9 R11 R17 R19 R23-R26 = RC0402JR-070RL: RES 0 OHM JUMPER 1/16W 0402; Manufacturer: Yageo; Value: 0mR; Power Rating: 62.5mW; Tolerance: 5%; Voltage Rating: 50V; Max Power Dissipation: 63mW; Temperature Coefficient: 200ppm/°C; Supplier: Digikey; Supplier Part Number: 311-0.0JRCT-ND; Manufacturer Part Number: RC0402JR-070RL; RoHS: Yes; Category: Chip SMD Resistors; Stock: 56253; Pricing: 1=0.1, 10=0.01, 25=0.0064, 50=0.0054, 100=0.0047, 250=0.00392, 500=0.00346, 1000=0.00304, 5000=0.0023 (USD); Case/Package: 0402; Contact Plating: Tin,Matte; Case Code (Imperial): 0402; Case Code (Metric): 1005; Min Operating Temperature: -55°C; Max Operating Temperature: 155°C; Packaging: Tape and Reel; Resistor Type: Thick Film; Number of Terminations: 2; Termination: SMD/SMT; Features: Moisture Resistant; Package Quantity: 1; Series: RC; Technology: THICK FILM; Resistance Tolerance: 5%; Construction: Rectangular; Length: 1mm; Width: 0.02inch; Height: 0.016inch; Depth: 0.5mm; Lead Free: 5697LeadFree; Reach SVHC Compliant: Unknown; Military Standard: Not; RoHS Compliant: Yes; LCSC Part Number: C60485
R4 R5 = RC0402FR-071KL: RES 1K OHM 1% 1/16W 0402; Manufacturer: Yageo; Value: 1kR; Temperature Coefficient: 100ppm/°C; Voltage Rating (DC): 50V; Power Rating: 62.5mW; Max Power Dissipation: 63mW; Supplier: Digikey; Supplier Part Number: 311-1.00KLRCT-ND; Manufacturer Part Number: RC0402FR-071KL; RoHS: Yes; Category: Chip SMD Resistors; Stock: 1169696; Pricing: 1=0.1, 10=0.007, 100=0.0061, 1000=0.0051, 2500=0.00408 (USD); Case/Package: 0402; Pins: 2; Case Code (Imperial): 0402; Case Code (Metric): 1005; Min Operating Temperature: -55°C; Max Operating Temperature: 155°C; Tolerance: 1%; Packaging: Tape and Reel; Voltage Rating: 50V; Termination: SMD/SMT; Number of Terminations: 2; Resistor Type: Thick Film; Features: Moisture Resistant; Voltage Rating (AC): 50V; Series: RC; Resistance Tolerance: 1%; Construction: Rectangular; Technology: THICK FILM; Length: 1mm; Width: 0.5mm; Height: 0.32mm; Depth: 0.5mm; Reach SVHC Compliant: No; Lead Free: 5697LeadFree; Military Standard: Not; RoHS Compliant: Yes; ComponentLink1URL: https://datasheet.ciiva.com/11819/0900766b80c66297-11819477.pdf?src-supplier=Rs; ComponentLink1Description: https://datasheet.ciiva.com/11819/0900766b80c66297-11819477.pdf?src-supplier=Rs; ComponentLink2URL: https://datasheet.ciiva.com/7983/1018594-7983502.pdf?src-supplier=Element14; ComponentLink2Description: https://datasheet.ciiva.com/7983/1018594-7983502.pdf?src-supplier=Element14; ComponentLink3URL: https://datasheet.ciiva.com/22747/1018594-22747513.pdf?src-supplier=Element14; ComponentLink3Description: https://datasheet.ciiva.com/22747/1018594-22747513.pdf?src-supplier=Element14; ComponentLink4URL: https://datasheet.ciiva.com/12666/pyu-rc0402-51-rohs-l-6-r-12666741.pdf?src-supplier=Mouser; ComponentLink4Description: https://datasheet.ciiva.com/12666/pyu-rc0402-51-rohs-l-6-r-12666741.pdf?src-supplier=Mouser; ComponentLink5URL: https://datasheet.ciiva.com/7849/1018594-7849869.pdf?src-supplier=Element14; ComponentLink5Description: https://datasheet.ciiva.com/7849/1018594-7849869.pdf?src-supplier=Element14; ComponentLink6URL: https://datasheet.ciiva.com/7849/1018594-7849871.pdf?src-supplier=Element14; ComponentLink6Description: https://datasheet.ciiva.com/7849/1018594-7849871.pdf?src-supplier=Element14; ComponentLink7URL: https://datasheet.ciiva.com/17063/pyu-rc0402-51-rohs-l-6-r-17063193.pdf?src-supplier=Future+Electronics; ComponentLink7Description: https://datasheet.ciiva.com/17063/pyu-rc0402-51-rohs-l-6-r-17063193.pdf?src-supplier=Future+Electronics; LCSC Part Number: C106235
R8 R10 R20 R21 = RC0402FR-0727RL: RES 27 OHM 1% 1/16W 0402; Manufacturer: Yageo; Power Rating: 62.5mW; Voltage Rating: 50V; Temperature Coefficient: 100ppm/°C; Max Power Dissipation: 63mW; Supplier: Digikey; Supplier Part Number: YAG3086CT-ND; Manufacturer Part Number: RC0402FR-0727RL; RoHS: Yes; Category: Chip SMD Resistors; Stock: 193120; Pricing: 1=0.1, 10=0.007, 100=0.0061, 1000=0.00408, 2500=0.00357 (USD); Case/Package: 0402; Case Code (Imperial): 0402; Case Code (Metric): 1005; Weight: 2.3E-05oz; Min Operating Temperature: -55°C; Max Operating Temperature: 155°C; Value: 27R; Tolerance: 1%; Packaging: Tape and Reel; Resistor Type: Thick Film; Termination: SMD/SMT; Number of Terminations: 2; Features: Moisture Resistant; Series: RC; Construction: Rectangular; Technology: THICK FILM; Resistance Tolerance: 1%; Voltage Rating (AC): 50V; Length: 1mm; Width: 0.5mm; Height: 0.016inch; Depth: 0.5mm; Military Standard: Not; Lead Free: Lead Free; RoHS Compliant: Yes; Reach SVHC Compliant: Unknown; ComponentLink1URL: https://datasheet.ciiva.com/11808/0900766b80c66297-11808450.pdf?src-supplier=Rs; ComponentLink1Description: https://datasheet.ciiva.com/11808/0900766b80c66297-11808450.pdf?src-supplier=Rs; ComponentLink2URL: https://datasheet.ciiva.com/17044/pyu-rc0402-51-rohs-l-6-17044345.pdf?src-supplier=Future+Electronics; ComponentLink2Description: https://datasheet.ciiva.com/17044/pyu-rc0402-51-rohs-l-6-17044345.pdf?src-supplier=Future+Electronics; ComponentLink3URL: https://datasheet.ciiva.com/7849/1018594-7849927.pdf?src-supplier=Element14; ComponentLink3Description: https://datasheet.ciiva.com/7849/1018594-7849927.pdf?src-supplier=Element14; ComponentLink4URL: https://datasheet.ciiva.com/7849/1018594-7849926.pdf?src-supplier=Element14; ComponentLink4Description: https://datasheet.ciiva.com/7849/1018594-7849926.pdf?src-supplier=Element14; ComponentLink5URL: https://datasheet.ciiva.com/15189/getdatasheetpartid-327852-15189402.pdf?src-supplier=Verical; ComponentLink5Description: https://datasheet.ciiva.com/15189/getdatasheetpartid-327852-15189402.pdf?src-supplier=Verical; LCSC Part Number: C138021
R12-R15 = AC0402FR-075K1L: RES SMD 5.1K OHM 1% 1/16W 0402; Manufacturer: Yageo; Value: 5.1kR; Power Rating: 63mW; Temperature Coefficient: 100ppm/°C; Voltage Rating: 50V; Supplier: Digikey; Supplier Part Number: YAG3503CT-ND; Manufacturer Part Number: AC0402FR-075K1L; RoHS: Yes; Category: Chip SMD Resistors; Stock: 65079; Pricing: 1=0.1, 10=0.009, 100=0.0071, 1000=0.00612, 2500=0.0051, 5000=0.00407 (USD); Mounting Technology: Surface Mount; Case/Package: 0402; Case Code (Metric): 1005; Case Code (Imperial): 0402; Min Operating Temperature: -55°C; Max Operating Temperature: 155°C; Tolerance: 1%; Packaging: Cut Tape; Number of Terminations: 2; Max Power Dissipation: 63mW; Features: Moisture Resistant,Automotive AEC-Q200; Series: AC; Length: 0.039inch; Width: 0.02inch; Height: 0.015inch; RoHS Compliant: Yes; Lead Free: 5697LeadFree; ComponentLink1URL: https://datasheet.octopart.com/AC0402FR-075K1L-Yageo-datasheet-166720450.pdf?src-supplier=Future+Electronics; ComponentLink1Description: https://datasheet.octopart.com/AC0402FR-075K1L-Yageo-datasheet-166720450.pdf?src-supplier=Future+Electronics; ComponentLink2URL: http://www.yageo.com/NewPortal/yageodocoutput?fileName=/pdf/R-Chip/PYu-AC_51_RoHS_L_6.pdf&src-supplier=Digikey; ComponentLink2Description: http://www.yageo.com/NewPortal/yageodocoutput?fileName=/pdf/R-Chip/PYu-AC_51_RoHS_L_6.pdf&src-supplier=Digikey; ComponentLink3URL: http://www.yageo.com/documents/recent/PYu-AC_51_RoHS_L_2_revised.pdf?src-supplier=Future+Electronics; ComponentLink3Description: http://www.yageo.com/documents/recent/PYu-AC_51_RoHS_L_2_revised.pdf?src-supplier=Future+Electronics; LCSC Part Number: C144745
SW1 SW2 = PTS645SH50SMTR92LFS: SWITCH TACTILE SPST-NO 0.05A 12V; Manufacturer: ITT C&K; Contact Current Rating: 50mA; Contact Resistance: 100mR; Number of Positions: 2NUMBER; Supplier: Digikey; Supplier Part Number: CKN9085CT-ND; Manufacturer Part Number: PTS645SH50SMTR92LFS; RoHS: Yes; Category: Tactile Switches; Stock: 19612; Pricing: 1=0.35, 10=0.3, 25=0.2804, 100=0.251, 250=0.23256, 500=0.21948 (USD); Lead Free: 5697LeadFree; ComponentLink1URL: https://datasheet.ciiva.com/29903/getdatasheetpartid-773702-29903807.pdf?src-supplier=Verical; ComponentLink1Description: https://datasheet.ciiva.com/29903/getdatasheetpartid-773702-29903807.pdf?src-supplier=Verical; ComponentLink2URL: https://datasheet.ciiva.com/14920/pts645-14920741.pdf?src-supplier=Digikey; ComponentLink2Description: https://datasheet.ciiva.com/14920/pts645-14920741.pdf?src-supplier=Digikey; ComponentLink3URL: https://datasheet.ciiva.com/22637/1707731-22637356.pdf?src-supplier=Element14; ComponentLink3Description: https://datasheet.ciiva.com/22637/1707731-22637356.pdf?src-supplier=Element14; LCSC Part Number: C221869
U1 = ESP32-S3-MINI-1-N8: SMD module, ESP32-S3FN8, 8 MB SPI flash, PCB antenna; Manufacturer: Espressif Systems; Supplier: Digikey; Supplier Part Number: 5407-ESP32-S3-MINI-1-N8CT-ND; Manufacturer Part Number: ESP32-S3-MINI-1-N8; RoHS: No; Category: LDO; Pricing: 1=5.28, 10=4.566, 25=4.3196, 100=3.9802, 250=3.7768 (USD); ComponentLink1URL: https://datasheet.octopart.com/ESP32-S3-MINI-1-N8-Espressif-Systems-datasheet-165560562.pdf?src-supplier=TME; ComponentLink1Description: https://datasheet.octopart.com/ESP32-S3-MINI-1-N8-Espressif-Systems-datasheet-165560562.pdf?src-supplier=TME; LCSC Part Number: C2913206
U2 = FT231XQ-R: IC USB SERIAL FULL UART 20QFN; Manufacturer: FTDI; Supplier: Digikey; Supplier Part Number: 768-1128-1-ND; Manufacturer Part Number: FT231XQ-R; RoHS: Yes; Category: Interface ICs; Stock: 29036; Pricing: 1=2.34, 25=2.27, 100=2.2, 250=2, 500=1.82002, 1000=1.7625 (USD); Height: 800um; Lead Free: 5697LeadFree; ComponentLink1URL: https://datasheet.ciiva.com/4787/ds-ft231x-13571-4787570.pdf?src-supplier=Mouser; ComponentLink1Description: https://datasheet.ciiva.com/4787/ds-ft231x-13571-4787570.pdf?src-supplier=Mouser; ComponentLink2URL: https://datasheet.ciiva.com/30475/0900766b811020d3-30475405.pdf?src-supplier=Rs; ComponentLink2Description: https://datasheet.ciiva.com/30475/0900766b811020d3-30475405.pdf?src-supplier=Rs; ComponentLink3URL: https://datasheet.ciiva.com/1787/ds-ft231x-1787312.pdf?src-supplier=Digikey; ComponentLink3Description: https://datasheet.ciiva.com/1787/ds-ft231x-1787312.pdf?src-supplier=Digikey; ComponentLink4URL: https://datasheet.ciiva.com/1787/ft-x-series-1787313.pdf?src-supplier=Digikey; ComponentLink4Description: https://datasheet.ciiva.com/1787/ft-x-series-1787313.pdf?src-supplier=Digikey; ComponentLink5URL: https://datasheet.ciiva.com/1787/ft-x-series-1787314.pdf?src-supplier=Digikey; ComponentLink5Description: https://datasheet.ciiva.com/1787/ft-x-series-1787314.pdf?src-supplier=Digikey; LCSC Part Number: C132159
U3 = TL1963A-33DCYR: IC REG LIN 3.3V 1.5A SOT-223-4; Manufacturer: Texas Instruments; Supplier: Digikey; Supplier Part Number: 296-24897-1-ND; Manufacturer Part Number: TL1963A-33DCYR; RoHS: Yes; Category: Voltage Regulators - Linear; Stock: 589; Pricing: 1=2.77, 10=2.069, 25=1.8936, 100=1.7, 250=1.60772, 500=1.55212, 1000=1.50634 (USD); Thickness: 1.6mm; Lead Free: 5697LeadFree; ComponentLink1URL: https://datasheet.ciiva.com/2046/-2046068.pdf?src-supplier=Digikey; ComponentLink1Description: https://datasheet.ciiva.com/2046/-2046068.pdf?src-supplier=Digikey; LCSC Part Number: C181262

## Assembly variants
Prototype: not fitted C6 C17 R3 R7 R9 R25 R26